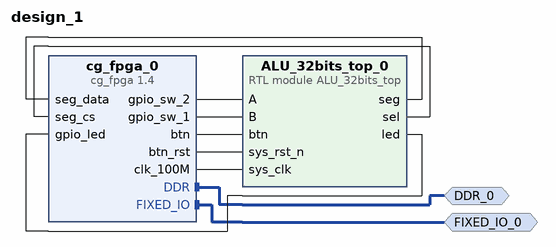
[diagram p0: block diagram of the top level]
# Vivado block design design_1, xc7z020clg400-1, Vivado 2018.3
create_bd_design design_1

create_bd_intf_port -mode Master -vlnv xilinx.com:interface:ddrx_rtl:1.0 DDR_0
create_bd_intf_port -mode Master -vlnv xilinx.com:display_processing_system7:fixedio_rtl:1.0 FIXED_IO_0

create_bd_cell -type ip -vlnv educg.net:user:cg_fpga:1.4 cg_fpga_0
create_bd_cell -type module -reference ALU_32bits_top ALU_32bits_top_0

# ---- connections ----

connect_bd_intf_net [get_bd_intf_ports DDR_0] [get_bd_intf_pins cg_fpga_0/DDR]
connect_bd_intf_net [get_bd_intf_ports FIXED_IO_0] [get_bd_intf_pins cg_fpga_0/FIXED_IO]
connect_bd_net [get_bd_pins ALU_32bits_top_0/seg] [get_bd_pins cg_fpga_0/seg_data]
connect_bd_net [get_bd_pins ALU_32bits_top_0/sel] [get_bd_pins cg_fpga_0/seg_cs]
connect_bd_net [get_bd_pins ALU_32bits_top_0/led] [get_bd_pins cg_fpga_0/gpio_led]
connect_bd_net [get_bd_pins cg_fpga_0/gpio_sw_2] [get_bd_pins ALU_32bits_top_0/A]
connect_bd_net [get_bd_pins cg_fpga_0/gpio_sw_1] [get_bd_pins ALU_32bits_top_0/B]
connect_bd_net [get_bd_pins cg_fpga_0/btn] [get_bd_pins ALU_32bits_top_0/btn]
connect_bd_net [get_bd_pins cg_fpga_0/btn_rst] [get_bd_pins ALU_32bits_top_0/sys_rst_n]
connect_bd_net [get_bd_pins cg_fpga_0/clk_100M] [get_bd_pins ALU_32bits_top_0/sys_clk]

validate_bd_design
save_bd_design
